# Altium schematic sheet CW340_SAM3X_MISC.SchDoc: MCU Misc Connections
size Letter; Organization: NewAE Technology Inc.; Address1: 1083 Queen St., Suite 196; Address2: Halifax; Address3: NS; Address4: Canada B3H 0B2; SheetApproved: NO
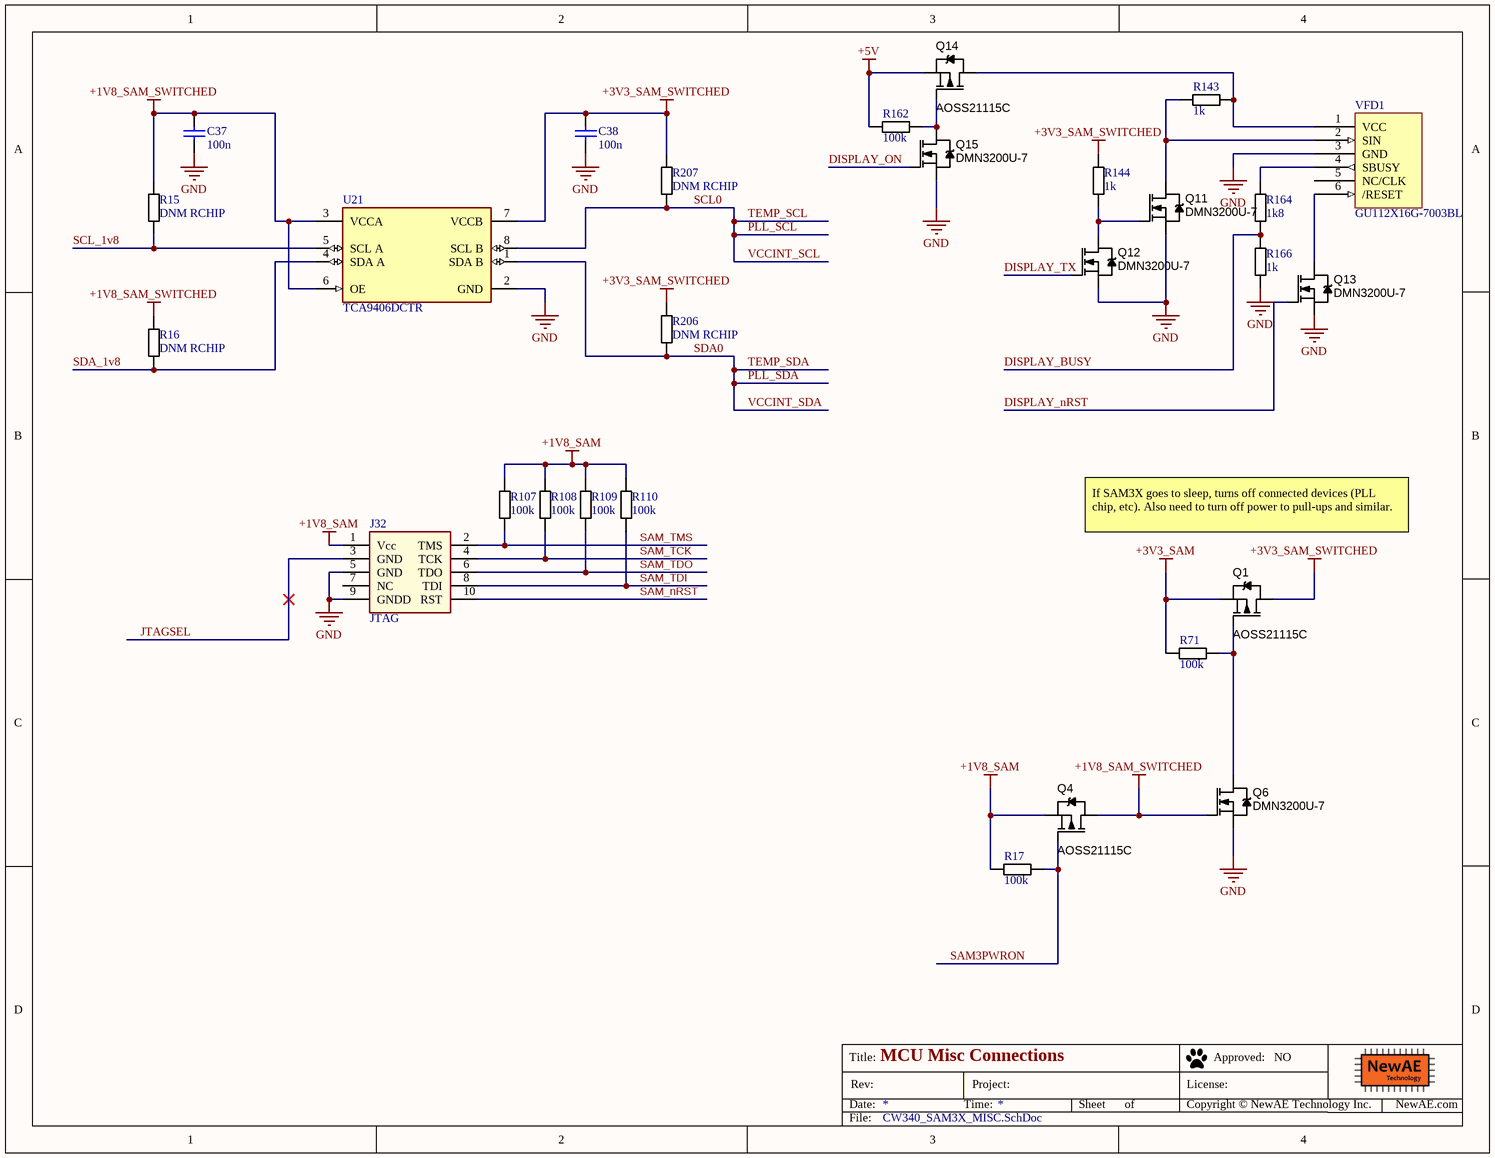
[diagram p0: CW340_SAM3X_MISC.SchDoc]

## Parts
C37  100n  [CAPC0402_M]
C38  100n  [CAPC0402_M]
J32  JTAG  [0.5mm_SMD_Header_5x2]
Q1  AOSS21115C  [SOT95P245X110-3M]
Q4  AOSS21115C  [SOT95P245X110-3M]
Q6  DMN3200U-7  [SOT95P245X110-3M]
Q11  DMN3200U-7  [SOT95P245X110-3M]
Q12  DMN3200U-7  [SOT95P245X110-3M]
Q13  DMN3200U-7  [SOT95P245X110-3M]
Q14  AOSS21115C  [SOT95P245X110-3M]
Q15  DMN3200U-7  [SOT95P245X110-3M]
R15  DNM RCHIP  [RESC1608X55N]
R16  DNM RCHIP  [RESC1608X55N]
R17  100k  [RESC1608X55N]
R71  100k  [RESC1608X55N]
R107  100k  [RESC1005X40N]
R108  100k  [RESC1005X40N]
R109  100k  [RESC1005X40N]
R110  100k  [RESC1005X40N]
R143  1k  [RESC1005X40N]
R144  1k  [RESC1005X40N]
R162  100k  [RESC1608X55N]
R164  1k8  [RESC1005X40N]
R166  1k  [RESC1005X40N]
R206  DNM RCHIP  [RESC1608X55N]
R207  DNM RCHIP  [RESC1608X55N]
U21  TCA9406DCTR  [FP-DCT0008A-MFG]
VFD1  GU112X16G-7003BL  [GU112X16G-7003BL]

## Nets
+1V8_SAM: J32.1(Vcc) Q4.2(S) R17.1 R107.1 R108.1 R109.1 R110.1
+1V8_SAM_SWITCHED: C37.1 Q4.3(D) Q6.1(G) R15.1 R16.1 U21.3(VCCA) U21.6(OE)
+3V3_SAM: Q1.2(S) R71.1
+3V3_SAM_SWITCHED: C38.1 Q1.3(D) R144.1 R206.1 R207.1 U21.7(VCCB)
+5V: Q14.2(S) R162.1
GND: C37.2 C38.2 J32.5(GND) J32.9(GNDD) Q6.2(S) Q11.2(S) Q12.2(S) Q13.2(S) Q15.2(S) R166.2 U21.2(GND) VFD1.3(GND)
DISPLAY_BUSY: R164.2 R166.1
DISPLAY_nRST: Q13.1(G)
DISPLAY_ON: Q15.1(G)
DISPLAY_TX: Q12.1(G)
JTAGSEL: J32.3(GND)
PLL_SCL: R207.2 U21.8(SCL_B)  [also labelled SCL0, TEMP_SCL, VCCINT_SCL]
PLL_SDA: R206.2 U21.1(SDA_B)  [also labelled SDA0, TEMP_SDA, VCCINT_SDA]
SAM3PWRON: Q4.1(G) R17.2
SAM_nRST: J32.10(RST)
SAM_TCK: J32.4(TCK) R108.2
SAM_TDI: J32.8(TDI) R110.2
SAM_TDO: J32.6(TDO) R109.2
SAM_TMS: J32.2(TMS) R107.2
SCL_1v8: R15.2 U21.5(SCL_A)
SDA_1v8: R16.2 U21.4(SDA_A)
NetQ1_1: Q1.1(G) Q6.3(D) R71.2
NetQ11_1: Q11.1(G) Q12.3(D) R144.2
NetQ11_3: Q11.3(D) R143.1 VFD1.2(SIN)
NetQ13_3: Q13.3(D) VFD1.6(/RESET)
NetQ14_1: Q14.1(G) Q15.3(D) R162.2
NetQ14_3: Q14.3(D) R143.2 VFD1.1(VCC)
NetR164_1: R164.1 VFD1.4(SBUSY)

Not connected (* = marked no-connect by the designer): J32 7(NC); VFD1 5(NC/CLK)

## Notes on the sheet
- If SAM3X goes to sleep, turns off connected devices (PLL chip, etc). Also need to turn off power to pull-ups and similar.
- Title:
- Date:
- Rev:
- Time:
- Project:
- Sheet
- of
- License:
- Copyright © NewAE Technology Inc.
- Approved:
- NewAE.com
- File:

## Library data of the parts
C37 C38 = CCHIP-100n-0402: 100n, 0402; Manufacture Part Number 1: CGA2B3X7R1V104K050BB; Component Group: Capacitor; Case-EIA: 0402; Part Number: CCHIP-100n-0402; Footprint: 0402; Pin Count: 2; Supplier 1: Digi-Key; Supplier Part Number 1: 445-6901-1-ND; Value: 100n; Mounting Technology: SMT; Component Kind: Standard; Component Type: Standard
J32 = Cortex_Debug_Header_10Pin: 10 Pin Cortex Program & Debug 0.5mm pitch; Manufacture 1: Samtec Inc; Manufacture Part Number 1: FTSH-105-01-L-DV-007-K; Component Group: Connector; PP Material Stack: 0; Part Number: Cortex_Debug_Header_10Pin; Pin Count: 10; Supplier 1: Digi-Key; Supplier Part Number 1: SAM9438-ND; Mounting Technology: SMT; RoHS: Yes; Component Kind: Standard; Component Type: Standard; PP Rotation: 0; Functionality: JTAG; 0_TEMP: 0.5mm_SMD_Header_5x2
Q1 Q4 Q14 = AOSS21115C: P-Channel, 4.5A, 1.8V Logic Level; Manufacture 1: Diodes Inc.; Component Group: MOSFET; Part Number: AOSS21115C; Footprint: SOT23; Manufacture Part Number 1: AOSS21115C; Pin Count: 3; Supplier 1: Digi-Key; Supplier Part Number 1: 785-AOSS21115CCT-ND; Mounting Technology: SMT; Component Kind: Standard; Component Type: Standard
Q6 Q11-Q13 Q15 = DMN3200U-7: MOSFET N-CH 30V 2.2A SOT23-3; Manufacture 1: Diodes Inc.; Rated Power: 3A; PP Material Stack: 0; Part Number: DMN3200U-7; Component Group: MOSFET; Footprint: SOT23; Manufacture Part Number 1: DMN3200U-7; Pin Count: 3; Supplier 1: Digi-Key; Supplier Part Number 1: DMN3200U-7DICT-ND; Rated Voltage: 30V; Mounting Technology: SMT; RoHS: Yes; Component Kind: Standard; Component Type: Standard; PP Rotation: 0
R15 R16 R206 R207 = RCHIP-DNM-0603: Do Not Mount Resistor; Case-EIA: 0603; Case-Metric: 1608; Part Number: RCHIP-DNM-0603; Component Group: Resistor; Footprint: 0603; Pin Count: 2; Mounting Technology: SMT; Component Kind: Standard; Component Type: Standard
R17 R71 R162 = RCHIP-100K-0603: 100k res, 0603, 1%, 1/10W; Manufacture 1: Yageo; Manufacture Part Number 1: RC0603FR-07100KL; Component Group: Resistor; Case-EIA: 0603; Case-Metric: 1608; Rated Power: 0.1W; Rated Voltage: 75VDC; Part Number: RCHIP-100K-0603; Footprint: 0603; Pin Count: 2; Supplier 1: Digi-Key; Supplier Part Number 1: 311-100KHRCT-ND; Value: 100k; Tolerance: 1%; Mounting Technology: SMT; Temperature Range: -55C to 155C; Component Kind: Standard; Component Type: Standard
R107-R110 = RCHIP-100K-0402: 100k res, 0402, 1%, 1/16W; Manufacture 1: Yageo; Manufacture Part Number 1: RC0402FR-07100KL; Component Group: Resistor; Case-EIA: 0402; Case-Metric: 1005; Rated Power: 0.063W; Rated Voltage: 75VDC; Part Number: RCHIP-100K-0402; Pin Count: 2; Supplier 1: Digi-Key; Supplier Part Number 1: 311-100KLRCT-ND; Value: 100k; Tolerance: 1%; Mounting Technology: SMT; Temperature Range: -55C to 155C; Component Kind: Standard; Component Type: Standard; Footprint: 0402
R143 R144 R166 = RCHIP-1K-0402: 1k res, 0402, 1%, 1/16W; Manufacture 1: Yageo; Manufacture Part Number 1: RC0402FR-071KL; Component Group: Resistor; Case-EIA: 0402; Case-Metric: 1005; Rated Power: 0.063W; Rated Voltage: 75VDC; Part Number: RCHIP-1K-0402; Footprint: 0402; Pin Count: 2; Supplier 1: Digi-Key; Supplier Part Number 1: 311-1.00KLRCT-ND; Value: 1k; Tolerance: 1%; Mounting Technology: SMT; Temperature Range: -55C to 155C; Component Kind: Standard; Component Type: Standard
R164 = RCHIP-1K8-0402: 1k8 res, 0402, 1%, 1/16W; Manufacture 1: Yageo; Manufacture Part Number 1: RC0402FR-071K8L; Component Group: Resistor; Case-EIA: 0402; Case-Metric: 1005; Rated Power: 0.063W; Rated Voltage: 75VDC; Part Number: RCHIP-1K8-0402; Footprint: 0402; Pin Count: 2; Supplier 1: Digi-Key; Supplier Part Number 1: 311-1.80KLRCT-ND; Value: 1k8; Tolerance: 1%; Mounting Technology: SMT; Temperature Range: -55C to 155C; Component Kind: Standard; Component Type: Standard
U21 = CMP-0314-00292-3: IC TRNSLTR BIDIRECTIONAL SM8; Output Type: Voltage; Low Level Output Current: 50mA; Turn-On Delay Time: 260ns; Number of Outputs: 2; Min Supply Voltage: 1.65V; High Level Output Current: -50mA; Data Rate: 24Mbps; Logic Function: Translator; Max Supply Voltage: 5.5V; Propagation Delay: 4.4ns; Packaging: Tape and Reel; Number of Channels: 2; Width: 2.9mm; REACH SVHC: No SVHC; Height: 1.2mm; Number of Bits: 2; Number of Pins: 8; Lead Free: Lead Free; RoHS Compliant: Yes; Case/Package: SSOP; Weight: 0.000705oz; Max Operating Temperature: 85°C; Contact Plating: Gold; Min Operating Temperature: -40°C; Radiation Hardening: No; Series: -; Length: 3.15mm; Package Quantity: 1
VFD1 = GU112X16G-7003BL: VFD Display; Component Group: PCB Feature; PP Material Stack: 0; Part Number: GU112X16G-7003BL; Pin Count: 6; Component Kind: Standard; Component Type: Standard; PP Rotation: 0; PP Rotation1: 0